# EAGLE design USBpowconn (EAGLE 9.0.1)
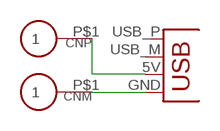
[diagram p0: schematic, sheet 1]

## Parts
CNM  CON_P01TH09MM  [PAD_TH09MM]
CNP  CON_P01TH09MM  [PAD_TH09MM]
JP1  CON_USBPCB  [USB-A-PCB]

## Nets
N$1: CNP.P$1 JP1.5V(VBUS)
N$2: CNM.P$1 JP1.GND
Unconnected: JP1.USB_M(D-) JP1.USB_P(D+)

## Library data of the parts
CNM CNP = akita:CON_P01
JP1 = akita:CON_USB: USB Connectors USB-B-PTH is fully proven SKU : PRT-00139/CONN-08278 USB-miniB is fully proven SKU : PRT-00587 USB-A-PCB is untested. USB-A-H is throughly reviewed, but untested. Spark Fun Electronics SKU : PRT-00437 USB-B-SMT is throughly reviewed, but untested. Needs silkscreen touching up. USB-A-S has not been used/tested USB-MB-H has not been used/tested USB-MICROB has been used. CONN-09505

## Board
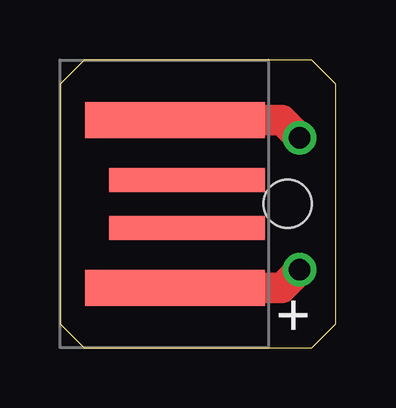
[diagram p1: board, top side]
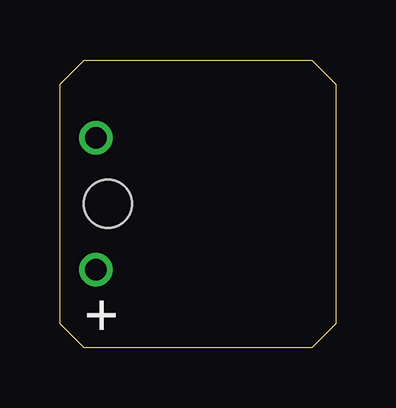
[diagram p2: board, bottom side, seen from below]

Size 11.5 x 12 mm. Coordinates in mm from the lower left corner, seen from the top.
Outline: 0,1 1,0 10.5,0 11.5,1 11.5,11 10.5,12 1,12 0,11 0,1
Copper layers (1*16): Top 0.035mm / dielectric 1.5mm / Bottom 0.035mm
Design rules "default": minimum track width 6mil, minimum drill 0.35mm, track to track 6mil, track to pad 6mil, pad to pad 6mil, via to via 6mil, smd to smd 6mil, copper to edge 40mil, drill to drill 6mil, minimum pad ring 10mil, minimum via ring 8mil, stop-mask expansion 4mil, vias tented up to drill 0mil, thermal gap 10mil
Holes 2 mm at 9.5,6

### Footprints (pad centres in the part's own frame; a part is rotated, then mirrored left to right if it is on the bottom)
PAD_TH09MM = drill 0.9: P$1 0,0
USB-A-PCB = smd 7.5 x 1.5: 5V -0.2,-3.5; GND -0.2,3.5 | smd 6.5 x 1: USB_M 0.3,-1; USB_P 0.3,1

### Placement (x,y rotation side)
CNM  10,8.75 0 top
CNP  10,3.25 0 top
JP1  5,6 0 top

### Tracks (layer width: path | path; a pad name or v marks a point on that pad's centre or on a via)
N$1
  Top 1.27: CNP.P$1 9.25,2.5 JP1.5V
N$2
  Top 1.27: CNM.P$1 9.25,9.5 JP1.GND

### Text on the board
tPlace: +
bPlace: +